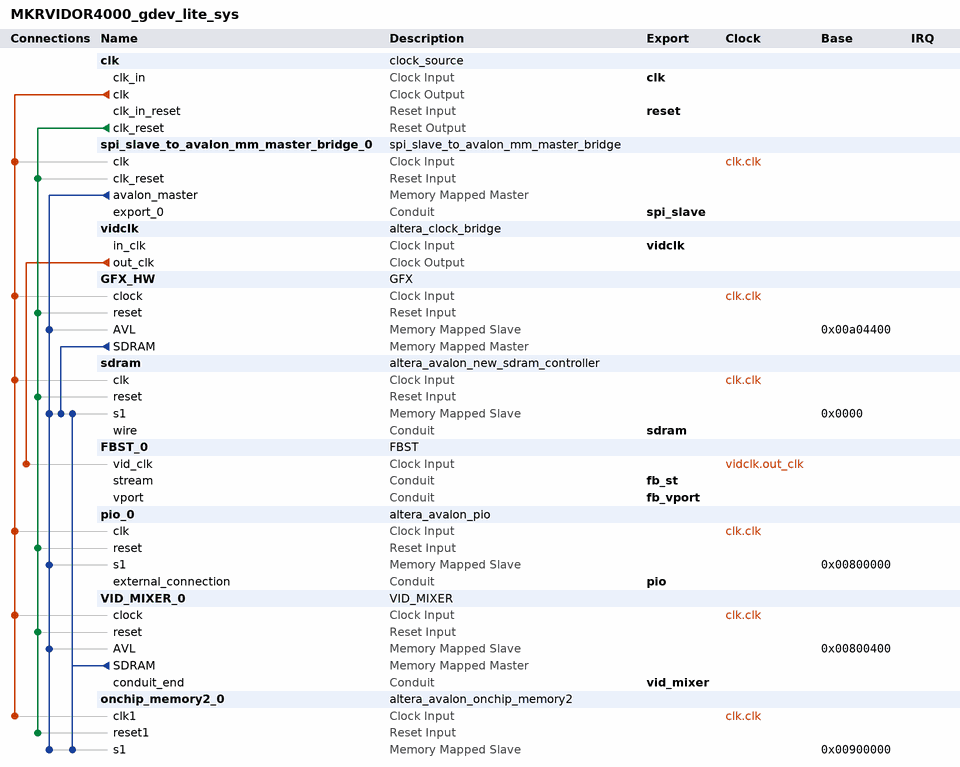
[diagram p0: system contents]
# Platform Designer (Qsys) system MKRVIDOR4000_gdev_lite_sys, Cyclone 10 LP 10CL016YU256C8G
# Parameters at their usual value, and those the tool derives, are not listed.
package require -exact qsys 18.1
create_system MKRVIDOR4000_gdev_lite_sys
set_project_property DEVICE_FAMILY {Cyclone 10 LP}
set_project_property DEVICE 10CL016YU256C8G

add_instance clk clock_source 18.1
set_instance_parameter_value clk clockFrequency 140000000

add_instance spi_slave_to_avalon_mm_master_bridge_0 spi_slave_to_avalon_mm_master_bridge 18.1
set_instance_parameter_value spi_slave_to_avalon_mm_master_bridge_0 SYNC_DEPTH 5

add_instance vidclk altera_clock_bridge 18.1
set_instance_parameter_value vidclk DERIVED_CLOCK_RATE 0
set_instance_parameter_value vidclk EXPLICIT_CLOCK_RATE 0

add_instance GFX_HW GFX 1.0
set_instance_parameter_value GFX_HW pADDRESS_BITS 22
set_instance_parameter_value GFX_HW pFB_OFFSET 614400
set_instance_parameter_value GFX_HW pFB_SIZE 307200

add_instance sdram altera_avalon_new_sdram_controller 18.1
set_instance_parameter_value sdram TAC 5.4
set_instance_parameter_value sdram TRCD 20.0
set_instance_parameter_value sdram TRP 20.0
set_instance_parameter_value sdram casLatency 2
set_instance_parameter_value sdram columnWidth 8
set_instance_parameter_value sdram dataWidth 16
set_instance_parameter_value sdram generateSimulationModel false
set_instance_parameter_value sdram model single_Micron_MT48LC4M32B2_7_chip
set_instance_parameter_value sdram numberOfBanks 4
set_instance_parameter_value sdram numberOfChipSelects 1
set_instance_parameter_value sdram powerUpDelay 200.0
set_instance_parameter_value sdram refreshPeriod 31.25
set_instance_parameter_value sdram rowWidth 12

add_instance FBST_0 FBST 1.0
set_instance_parameter_value FBST_0 pHRES 640
set_instance_parameter_value FBST_0 pHSE 752
set_instance_parameter_value FBST_0 pHSS 656
set_instance_parameter_value FBST_0 pHTOTAL 762
set_instance_parameter_value FBST_0 pVRES 480
set_instance_parameter_value FBST_0 pVSE 492
set_instance_parameter_value FBST_0 pVSS 490
set_instance_parameter_value FBST_0 pVTOTAL 525

add_instance pio_0 altera_avalon_pio 18.1
set_instance_parameter_value pio_0 direction Output
set_instance_parameter_value pio_0 width 1

add_instance VID_MIXER_0 VID_MIXER 1.0
set_instance_parameter_value VID_MIXER_0 pADDR_BITS 23

add_instance onchip_memory2_0 altera_avalon_onchip_memory2 18.1
set_instance_parameter_value onchip_memory2_0 dataWidth 16
set_instance_parameter_value onchip_memory2_0 dualPort false
set_instance_parameter_value onchip_memory2_0 initMemContent false
set_instance_parameter_value onchip_memory2_0 initializationFileName onchip_mem.hex
set_instance_parameter_value onchip_memory2_0 memorySize 32768

# connections
add_connection clk.clk GFX_HW.clock clock
add_connection clk.clk onchip_memory2_0.clk1 clock
add_connection clk.clk pio_0.clk clock
add_connection clk.clk sdram.clk clock
add_connection clk.clk spi_slave_to_avalon_mm_master_bridge_0.clk clock
add_connection clk.clk VID_MIXER_0.clock clock
add_connection vidclk.out_clk FBST_0.vid_clk clock
add_connection clk.clk_reset GFX_HW.reset reset
add_connection clk.clk_reset onchip_memory2_0.reset1 reset
add_connection clk.clk_reset pio_0.reset reset
add_connection clk.clk_reset sdram.reset reset
add_connection clk.clk_reset spi_slave_to_avalon_mm_master_bridge_0.clk_reset reset
add_connection clk.clk_reset VID_MIXER_0.reset reset
add_connection GFX_HW.SDRAM sdram.s1 avalon
set_connection_parameter_value GFX_HW.SDRAM/sdram.s1 baseAddress 0x0000
add_connection spi_slave_to_avalon_mm_master_bridge_0.avalon_master GFX_HW.AVL avalon
set_connection_parameter_value spi_slave_to_avalon_mm_master_bridge_0.avalon_master/GFX_HW.AVL baseAddress 0x00a04400
add_connection spi_slave_to_avalon_mm_master_bridge_0.avalon_master onchip_memory2_0.s1 avalon
set_connection_parameter_value spi_slave_to_avalon_mm_master_bridge_0.avalon_master/onchip_memory2_0.s1 baseAddress 0x00900000
add_connection spi_slave_to_avalon_mm_master_bridge_0.avalon_master pio_0.s1 avalon
set_connection_parameter_value spi_slave_to_avalon_mm_master_bridge_0.avalon_master/pio_0.s1 baseAddress 0x00800000
add_connection spi_slave_to_avalon_mm_master_bridge_0.avalon_master sdram.s1 avalon
set_connection_parameter_value spi_slave_to_avalon_mm_master_bridge_0.avalon_master/sdram.s1 baseAddress 0x0000
add_connection spi_slave_to_avalon_mm_master_bridge_0.avalon_master VID_MIXER_0.AVL avalon
set_connection_parameter_value spi_slave_to_avalon_mm_master_bridge_0.avalon_master/VID_MIXER_0.AVL baseAddress 0x00800400
add_connection VID_MIXER_0.SDRAM onchip_memory2_0.s1 avalon
set_connection_parameter_value VID_MIXER_0.SDRAM/onchip_memory2_0.s1 baseAddress 0x00900000
add_connection VID_MIXER_0.SDRAM sdram.s1 avalon
set_connection_parameter_value VID_MIXER_0.SDRAM/sdram.s1 baseAddress 0x0000

# exported interfaces
add_interface clk clock sink
set_interface_property clk EXPORT_OF clk.clk_in
add_interface fb_st conduit end
set_interface_property fb_st EXPORT_OF FBST_0.stream
add_interface fb_vport conduit end
set_interface_property fb_vport EXPORT_OF FBST_0.vport
add_interface pio conduit end
set_interface_property pio EXPORT_OF pio_0.external_connection
add_interface reset reset sink
set_interface_property reset EXPORT_OF clk.clk_in_reset
add_interface sdram conduit end
set_interface_property sdram EXPORT_OF sdram.wire
add_interface spi_slave conduit end
set_interface_property spi_slave EXPORT_OF spi_slave_to_avalon_mm_master_bridge_0.export_0
add_interface vid_mixer conduit end
set_interface_property vid_mixer EXPORT_OF VID_MIXER_0.conduit_end
add_interface vidclk clock sink
set_interface_property vidclk EXPORT_OF vidclk.in_clk

set_interconnect_requirement {$system} qsys_mm.clockCrossingAdapter HANDSHAKE
set_interconnect_requirement {$system} qsys_mm.enableEccProtection FALSE
set_interconnect_requirement {$system} qsys_mm.insertDefaultSlave FALSE
set_interconnect_requirement {$system} qsys_mm.maxAdditionalLatency 1

save_system MKRVIDOR4000_gdev_lite_sys.qsys
